# Altium schematic sheet Sensors.SchDoc
size 241 x 190 mm; SheetNumber: 3; SheetTotal: 4
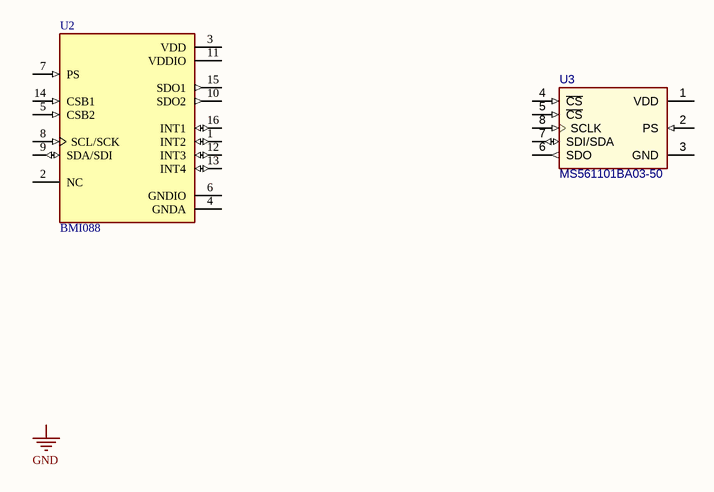
[diagram p0: Sensors.SchDoc]

## Parts
U2  BMI088  [PQFN50P450X300X100-16N]
U3  MS561101BA03-50  [TECO-MS561101BA03_V]

## Nets

Not connected (* = marked no-connect by the designer): U2 1(INT2) 2(NC) 3(VDD) 4(GNDA) 5(CSB2) 6(GNDIO) 7(PS) 8(SCL/SCK) 9(SDA/SDI) 10(SDO2) 11(VDDIO) 12(INT3) 13(INT4) 14(CSB1) 15(SDO1) 16(INT1); U3 1(VDD) 2(PS) 3(GND) 4(~{CS}) 5(~{CS}) 6(SDO) 7(SDI/SDA) 8(SCLK)

## Notes on the sheet
- Labels drawn without touching a wire or pin: GND
- Title
- Author
- Date
- Texas A&M Sounding Rocketry Team
- Revision

## Library data of the parts
U2 = CMP-048-000001-2: High-performance 6-axis inertial sensor (accelerometer + gyroscope) <a href="https://pricing.snapeda.com/parts/BMI088/Bosch%20Sensortec/view-part?ref=eda">Check prices</a>; Price: None; Value: *; Pin Count: 16; Package: None; Availability: Unavailable; Source: BMI088.SchLib; Component Type: Standard; Design Item ID: BMI088; MP: BMI088
U3 = CMP-010-00021-3: Barometric Pressure Sensor, 1.8 to 3.6 V, -40 to 85 degC, 8-Pin SMD, RoHS, Tape and Reel; Min Supply Voltage: 1.8V; Max Supply Voltage: 3.6V; Sensor Type: Barometer; Pins: 8; RoHS Compliant: Yes; Mounting Technology: SMT; Case/Package: LGA-8; Min Operating Temperature: -40°C; Max Operating Temperature: 85°C